# Altium schematic sheet Counter_165B.SchDoc: Lattice MachXO Standard Evaluation Board
size B
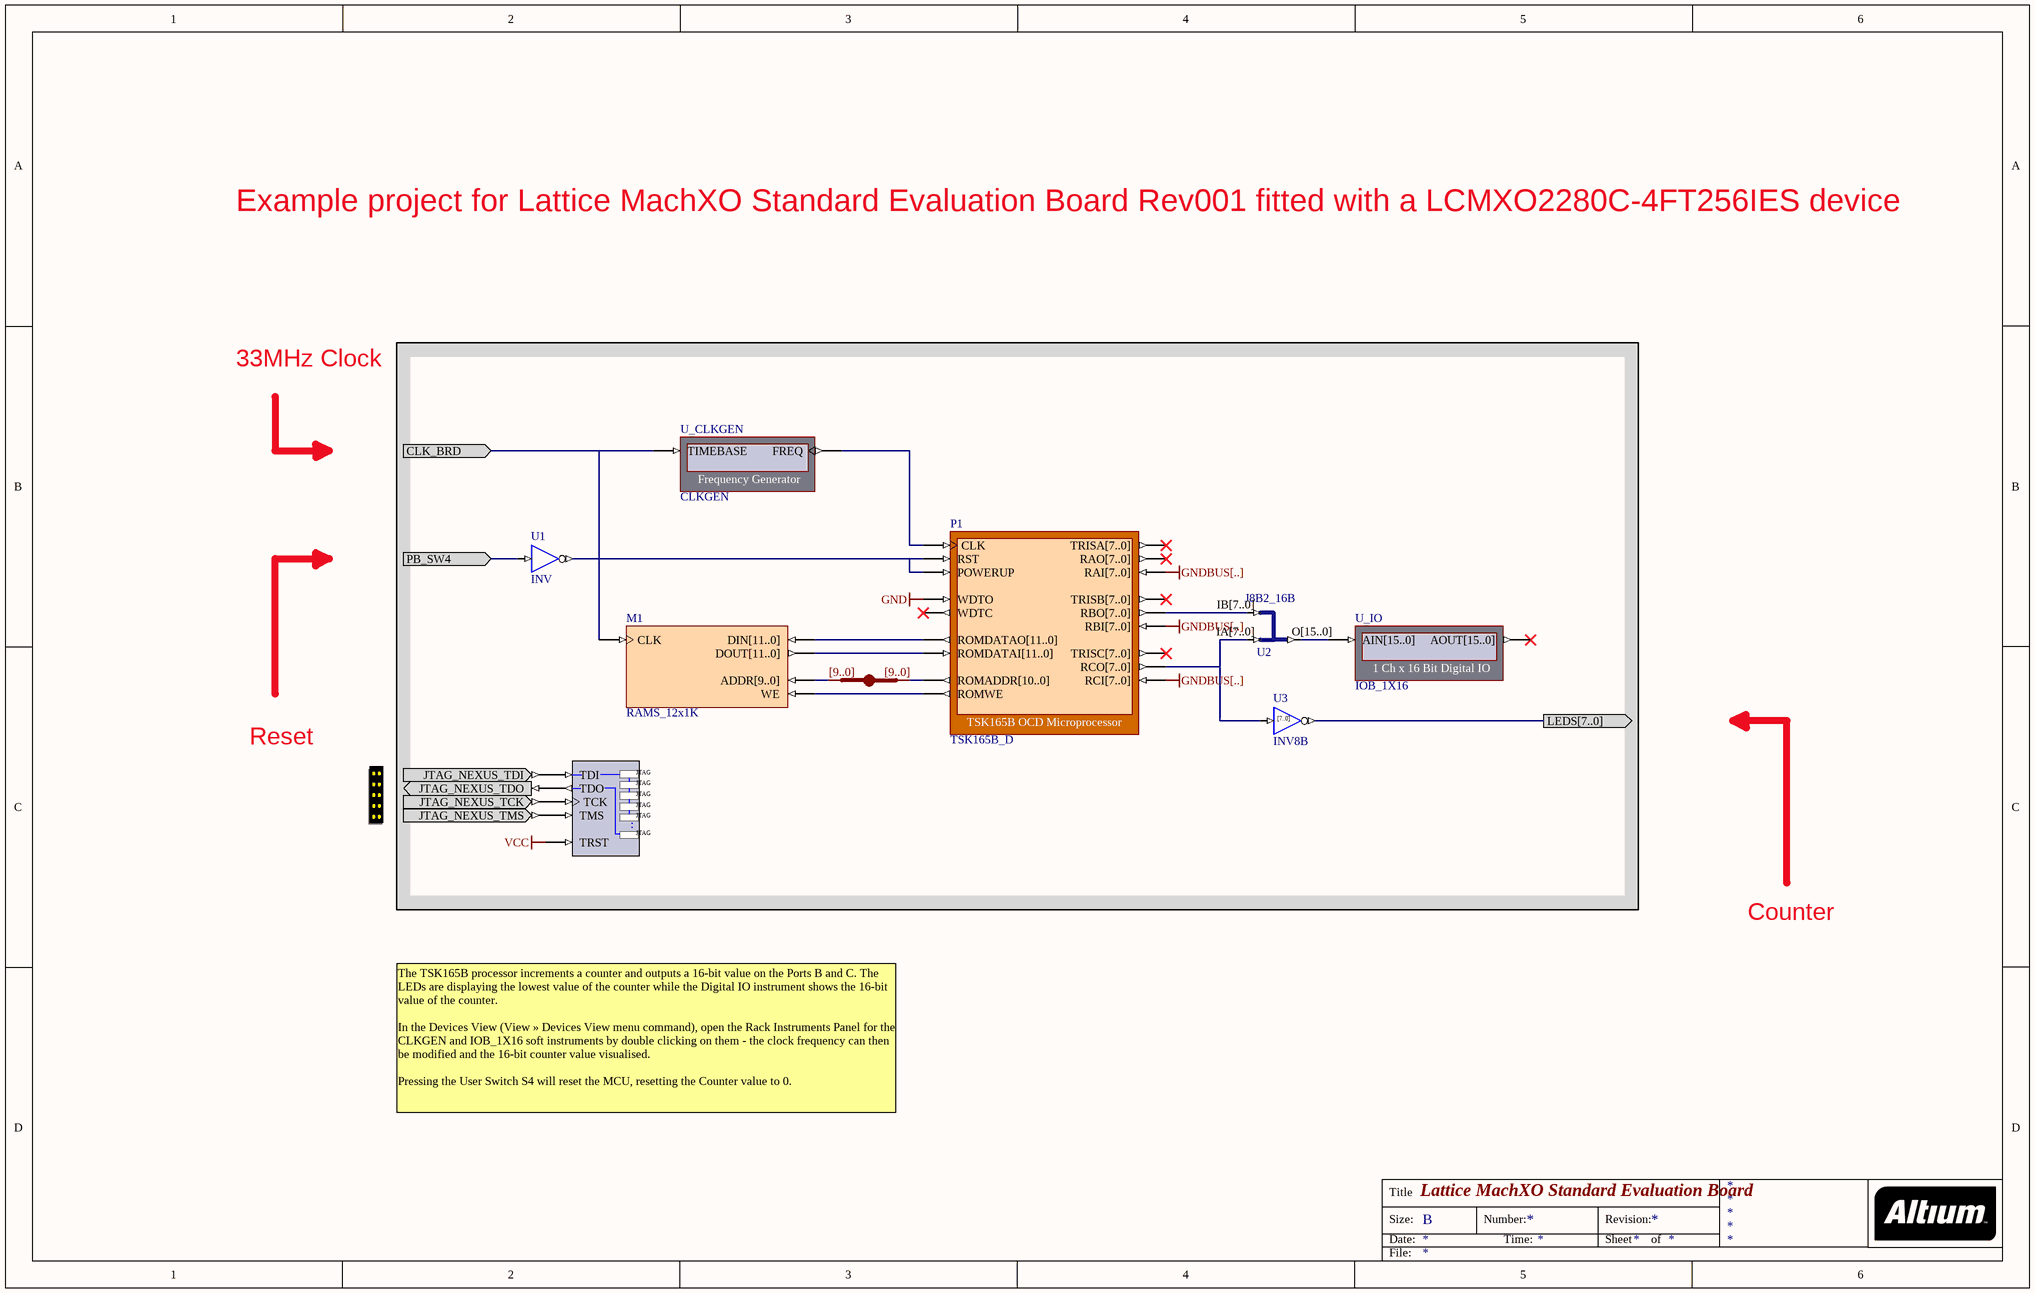
[diagram p0: Counter_165B.SchDoc]

## Parts
?  NEXUS_JTAG_CONNECTOR  (value not drawn)
JB_AUTO?  IndexA: [9..0]  (hidden comment: JB)
M1  RAMS_12x1K
NEXUS_JTAG_PORT  NEXUS_JTAG_PORT  (value not drawn)
P1  TSK165B_D
U1  INV
U2  J8B2_16B
U3  INV8B
U_CLKGEN  CLKGEN
U_IO  IOB_1X16

## Ports
CLK_BRD (in), LEDS[7..0] (out), PB_SW4 (in)

## Nets
GND: P1.WDTO
GNDBUS[..]: P1.RAI[7..0] P1.RBI[7..0] P1.RCI[7..0]
VCC: NEXUS_JTAG_PORT.TRST
CLK_BRD: M1.CLK U_CLKGEN.TIMEBASE ; port CLK_BRD
LEDS[7..0]: U3.O[7..0] ; port LEDS[7..0]
PB_SW4: U1.I ; port PB_SW4
Net?_JTAG_NEXUS_TCK: ?.JTAG_NEXUS_TCK NEXUS_JTAG_PORT.TCK
Net?_JTAG_NEXUS_TDI: ?.JTAG_NEXUS_TDI NEXUS_JTAG_PORT.TDI
Net?_JTAG_NEXUS_TDO: ?.JTAG_NEXUS_TDO NEXUS_JTAG_PORT.TDO
Net?_JTAG_NEXUS_TMS: ?.JTAG_NEXUS_TMS NEXUS_JTAG_PORT.TMS
NetJB_AUTO?_A[0..0]: JB_AUTO?.A[0..0] M1.ADDR[9..0]
NetJB_AUTO?_B[0..0]: JB_AUTO?.B[0..0] P1.ROMADDR[10..0]
NetM1_DIN[11..0]: M1.DIN[11..0] P1.ROMDATAO[11..0]
NetM1_DOUT[11..0]: M1.DOUT[11..0] P1.ROMDATAI[11..0]
NetM1_WE: M1.WE P1.ROMWE
NetP1_CLK: P1.CLK U_CLKGEN.FREQ
NetP1_POWERUP: P1.POWERUP P1.RST U1.O
NetP1_RBO[7..0]: P1.RBO[7..0] U2.IB[7..0]
NetP1_RCO[7..0]: P1.RCO[7..0] U2.IA[7..0] U3.I[7..0]
NetU2_O[15..0]: U2.O[15..0] U_IO.AIN[15..0]

Not connected (* = marked no-connect by the designer): P1 RAO[7..0]* TRISA[7..0]* TRISB[7..0]* TRISC[7..0]* WDTC*; U_IO AOUT[15..0]*

## Notes on the sheet
- Example project for Lattice MachXO Standard Evaluation Board Rev001 fitted with a LCMXO2280C-4FT256IES device
- 33MHz Clock
- Reset
- Counter
- The TSK165B processor increments a counter and outputs a 16-bit value on the Ports B and C. The LEDs are displaying the lowest value of the counter while the Digital IO instrument shows the 16-bit value of the counter.
  In the Devices View (View » Devices View menu command), open the Rack Instruments Panel for the CLKGEN and IOB_1X16 soft instruments by double clicking on them - the clock frequency can then be modified and the 16-bit counter value visualised.
  Pressing the User Switch S4 will reset the MCU, resetting the Counter value to 0.
- Title
- Size:
- Date:
- B
- Number:
- Time:
- Revision:
- Sheet
- of
- File:
- (in symbol INV8B) [7..0]
- (in symbol NEXUS_JTAG_PORT) .

## Library data of the parts
? = NEXUS_JTAG_CONNECTOR: JTAG Port; PortComponent: True; Published: 19-Nov-2003; Publisher: Altium Limited; HelpURL: TR0102 NanoBoard Technical Reference Manual - NB1.pdf#page=33
JB_AUTO? = JB: System BUS Joiner; Published: 29-Jan-2004; Publisher: Altium Limited; LastRevisionNo: 1.00.00; HelpURL: CR0118 FPGA Generic Library Guide.pdf#page=297; FunctionalClass: Bus Joiner; IndexB: [9..0]
M1 = RAMS_12x1K: Single Port RAM; Memory_Depth: 1024; Memory_Type: RAM_SinglePortBlock; Memory_Width: 12; Memory_ClockEdge: Rising; Nexus_Core: Memory_Program; Memory_EnablePin: False; Published: 11/10/2004; Publisher: Altium Hobart Technology Center; Memory_ByteWrites: False
NEXUS_JTAG_PORT = NEXUS_JTAG_PORT: Soft Nexus-Chain Connector; NEXUS_JTAG_CONNECTOR: True; FunctionalClass: JTAG; Published: 29-Jan-2004; Publisher: Altium Limited; LastRevisionNo: 1.00.00; HelpURL: CR0118 FPGA Generic Library Guide.pdf#page=405
P1 = TSK165B_D: TSK165B OCD Microprocessor; NEXUS_CORE: Processor_OCDS; NEXUS_JTAG_DEVICE: True; NEXUS_JTAG_ORDER: 0; ChildModel1: TSK165B_D_RAM128x8; ChildCore1: M1; ChildModel2: TSK165B_D_RAM128x8_prim0; Published: 17-Nov-2004; Publisher: Altium Limited; ComponentLink1Description: Core &Resource Usage; ComponentLink1URL: CR0140 FPGA Processor Resource Usage.pdf#page=19; HelpURL: CR0114 TSK165x RISC MCU.pdf; LastRevisionNo: 1.00.00; ComponentLink2Description: Embedded &Tools Guide; ComponentLink2URL: GU0108 Using the TSK165x Embedded Tools.pdf; ComponentLink3Description: Embedded T&echnical References; ComponentLink3URL: TR0106 TSK165x Embedded Tools Reference.pdf
U1 = INV: Inverter; FunctionalClass: Logic Primitive; ArchiveName: GENERIC; VHDLIB_SIM: GENERIC_LIB; Published: 29-Jan-2004; Publisher: Altium Limited; XilinxEquivalent: INV; LastRevisionNo: 1.00.00; HelpURL: CR0118 FPGA Generic Library Guide.pdf#page=291; ComponentLink1URL: CR0136 FPGA Logic Primitive Resource Usage.pdf#page=61; ComponentLink1Description: Core &Resource Usage; SubClass: INV
U2 = J8B2_16B: 2 x 8-Bit input bus to 1 x 16-bit output bus; FunctionalClass: Bus Joiner; PortSize: 8; ArchiveName: GENERIC; VHDLIB_SIM: GENERIC_LIB; Published: 29-Jan-2004; Publisher: Altium Limited; LastRevisionNo: 1.00.00; HelpURL: CR0118 FPGA Generic Library Guide.pdf#page=302; ComponentLink1URL: CR0126 FPGA Bus Joiner Resource Usage.pdf#page=23; ComponentLink1Description: Core &Resource Usage
U3 = INV8B: 8-Bit Inverter, Bus Version; XilinxEquivalent: INV8; FunctionalClass: Logic Primitive; SubClass: INV; PortSize: 8; ArchiveName: GENERIC; VHDLIB_SIM: GENERIC_LIB; Published: 29-Jan-2004; Publisher: Altium Limited; LastRevisionNo: 1.00.00; HelpURL: CR0118 FPGA Generic Library Guide.pdf#page=291; ComponentLink1URL: CR0136 FPGA Logic Primitive Resource Usage.pdf#page=74; ComponentLink1Description: Core &Resource Usage; PortStyle: Bus Version
U_CLKGEN = CLKGEN: Frequency Generator; NEXUS_CORE: Instrument; NEXUS_JTAG_DEVICE: True; NEXUS_JTAG_ORDER: 0; Published: 3-Nov-2004; Publisher: Altium Limited; Core Revision: 1.00.00; ComponentLink1Description: Core &Resource Usage; ComponentLink1URL: CR0134 FPGA Instrument Resource Usage.pdf#page=2; HelpURL: CR0100 CLKGEN Frequency Generator.pdf; LastRevisionNo: 1.00.00
U_IO = IOB_1X16: 1 Ch x 16 Bit Digital IO; NEXUS_CORE: Instrument; NEXUS_JTAG_DEVICE: True; NEXUS_JTAG_ORDER: 0; Published: 3-Nov-2004; Publisher: Altium Limited; Core Revision: 1.00.00; ComponentLink1Description: Core &Resource Usage; ComponentLink1URL: CR0134 FPGA Instrument Resource Usage.pdf#page=5; HelpURL: CR0102 IOB_x Digital IO Module.pdf; LastRevisionNo: 1.00.00